# Altium project CHILD_BOARD.PrjPcb (part 2 of 2)

## Sheet 3V3_AUX.SchDoc
size A4; SheetNumber: 7; SheetTotal: 8
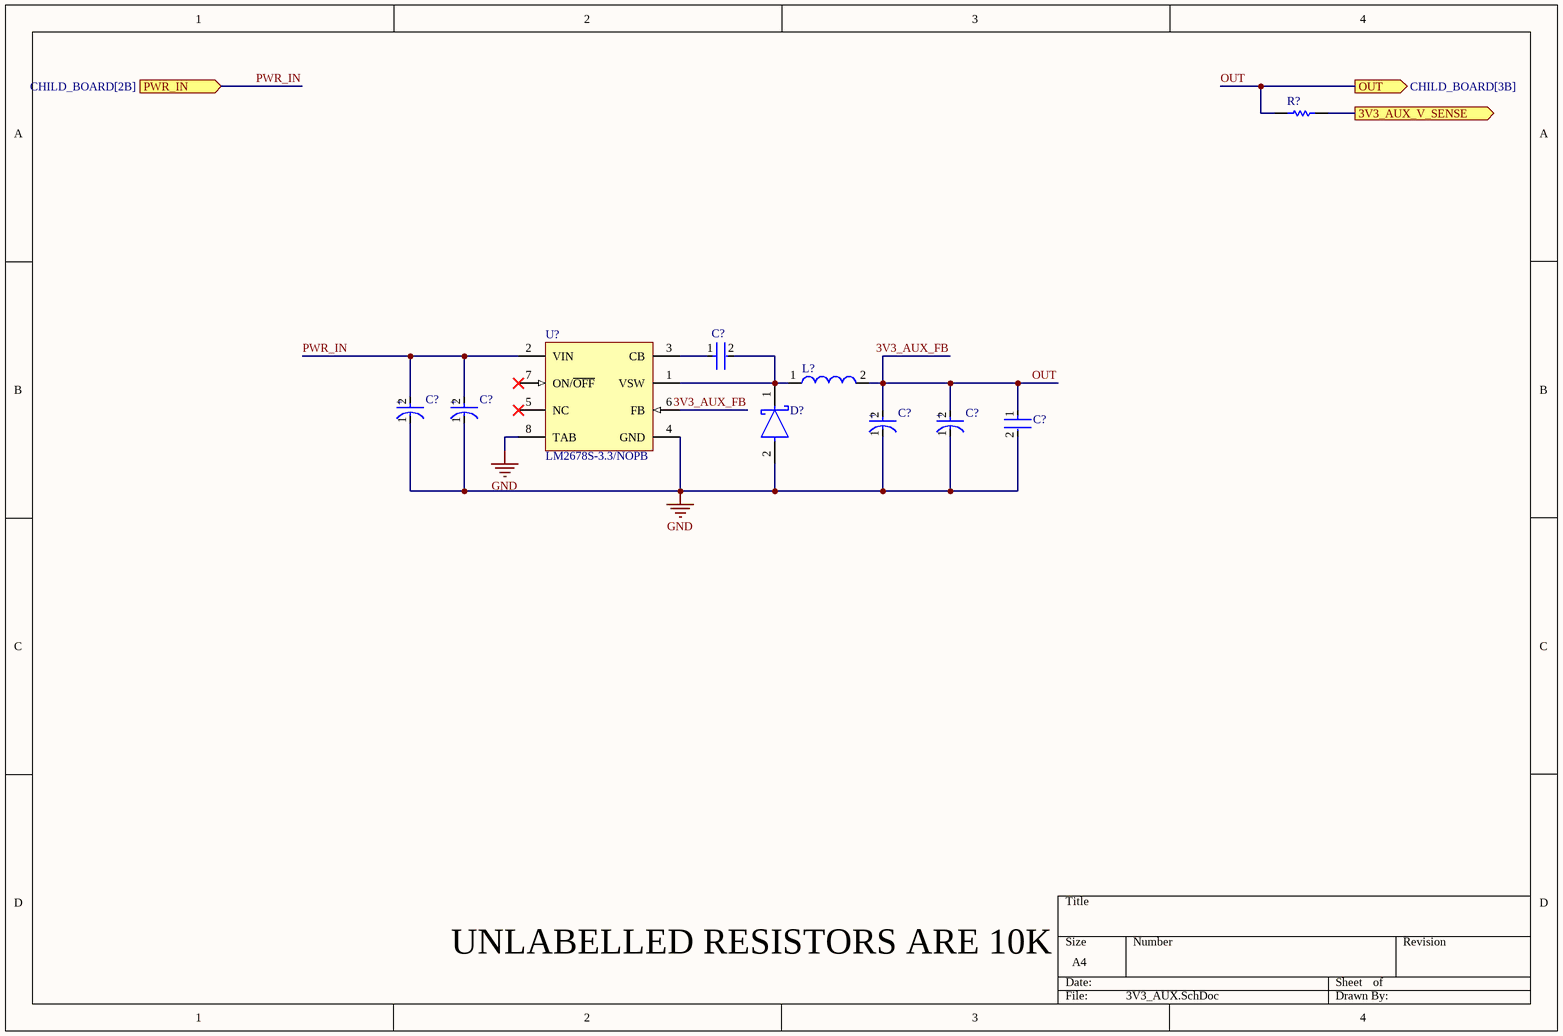
[diagram p6: 3V3_AUX.SchDoc]

### Parts
(Parts that share a designator on the sheet are numbered #1, #2 ... from top to bottom, then left to right.)
C?#43  C0805C103J5RACTU  [FP-C0805C-DN-MFG]  (value not drawn)
C?#44  EEHZA1V680XP  [FP-EEH-D8-MFG]  (value not drawn)
C?#45  EEHZA1V680XP  [FP-EEH-D8-MFG]  (value not drawn)
C?#46  16SVPC120M  [FP-OS-CON-SMT-E7-MFG]  (value not drawn)
C?#47  16SVPC120M  [FP-OS-CON-SMT-E7-MFG]  (value not drawn)
C?#48  GRM21BR61E226ME44L  [FP-GRM21B-0_2-e0_2_0_7-IPC_B]  (value not drawn)
D?#5  B540C-13-F  [FP-SMC-MFG]  (value not drawn)
L?#5  74477110  [WE-PD-L]  (value not drawn)
R?#71  ERJ3EKF1002V  [RESC1609X55X30LL15T15]  (value not drawn)
U?#11  LM2678S-3.3/NOPB  [KTW0007B_N]

### Ports
3V3_AUX_V_SENSE (out), OUT (out, see CHILD_BOARD[3B]), PWR_IN (in, see CHILD_BOARD[2B])

### Nets
3V3_AUX_FB: C?#46.2(A) C?#47.2(A) C?#48.1 L?#5.2 R?#71.1 U?#11.6(FB) ; port OUT  [also labelled OUT]
GND: C?#44.1(C) C?#45.1(C) C?#46.1(C) C?#47.1(C) C?#48.2 D?#5.2(A) U?#11.4(GND) U?#11.8(TAB)
3V3_AUX_V_SENSE: R?#71.2 ; port 3V3_AUX_V_SENSE
PWR_IN: C?#44.2(A) C?#45.2(A) U?#11.2(VIN) ; port PWR_IN  [project net 3V3_AUX_VCC]
NetC?#43_1: C?#43.1 U?#11.3(CB)
NetC?#43_2: C?#43.2 D?#5.1(C) L?#5.1 U?#11.1(VSW)

Not connected (* = marked no-connect by the designer): U?#11 5(NC)* 7(ON/~{OFF})*

### Notes on the sheet
- UNLABELLED RESISTORS ARE 10K
- (in symbol CMP-05428-000021-2) +
- (in symbol CMP-05428-001211-1) +

### Library data of the parts
C?#43 = CMP-2007-00254-2: CAP CER 10000PF 50V X7R 0805; Manufacturer: KEMET; Value: 10,000 pF; Material: Ceramic; Temperature Coefficient: 30ppm/°C; Tolerance: 0.05; Device Class L1: Passive Components; Temperature: -55°C to +125°C; Lead Free: Yes; ComponentLink2URL: https://content.kemet.com/datasheets/KEM_C1003_C0G_SMD.pdf; Device Class L3: Ceramic Capacitors; Temperature Characteristic: X7R; Temperature Range High: +125°C; Mouser Description: Capacitor; Ceramic; Cap 0.01uF; Tol 5%; Vol-Rtg 50 V; SMT; Case 0805; X7R; TR; ComponentLink2Description: Datasheet; Manufacturer Part Number: C0805C103J5RACTU; Height: 0.88mm; Digikey Description: CAP CER 10000PF 50V X7R 0805; Capacitance: 10,000 pF; Temperature Range Low: -55°C; Device Class L2: Capacitors; Octopart: https://octopart.com/c0805c103j5ractu-kemet-133473; Voltage Rating: 50 V; Category: Cap; RoHS: TRUE; Automotive: No; Package: C0805C-DN; Ipc Land Pattern Name: CAPC200125X78
C?#44 C?#45 = CMP-05428-001211-1: Conductive Polymer Hybrid Aluminum Electrolytic Capacitors 68uF ±20% 35V RADIAL SMT 6.3x7.7mm; Leakage Current: 23.8uA; Ripple Current (AC): 2A; Polarity: Polar; Life (Hours): 5000Hour; ESR (Equivalent Series Resistance): 35mR; Lead Diameter: 0.65mm; Termination: SMD/SMT; Case/Package: Radial; Package Quantity: 900; Radiation Hardening: No; Max Operating Temperature: 105°C; Capacitance: 68uF; Voltage Rating: 35V; Number of Pins: 8; Mount: Surface Mount; Technology: HYBRID; Diameter: 6.3mm; Min Operating Temperature: -55°C; Length: 7.7mm; Ratings: AEC-Q200; Height - Seated (Max): 0.315inch; Ripple Current: 2A; Lead Free: Lead Free; Voltage: 35V; Lead Pitch: 1.8mm; Voltage Rating (DC): 35V; REACH SVHC: No SVHC; Material: Polymer; Height: 7.7mm; Tolerance: 20%; Construction: Cylindrical; Packaging: Tape and Reel; Series: ZA
C?#46 C?#47 = CMP-05428-000021-2: Conductive Polymer Aluminum Solid Capacitors (OS-CON) 120uF ±20% 16V RADIAL SMT 8x6.9mm; Leakage Current: 500uA; Ripple Current: 2.9A; ESR (Equivalent Series Resistance): 27mR; Polarity: Polar; Dissipation Factor: 12%; Life (Hours): 2000Hour; Lead Free: Lead Free; Voltage Rating (DC): 16V; Min Operating Temperature: -55°C; Height - Seated (Max): 0.276inch; Case/Package: Radial; REACH SVHC: No SVHC; Diameter: 8mm; Mount: Surface Mount; Package Quantity: 1000; Construction: Cylindrical; Max Operating Temperature: 105°C; Capacitance: 120uF; Voltage: 16V; Length: 6.9mm; Tolerance: 20%; RoHS Compliant: Yes; Series: OS-CON, SVPC; Packaging: Tape and Reel; Voltage Rating: 16V; Termination: SMD/SMT; Number of Pins: 7; Ripple Current (AC): 2.9A; Height: 6.9mm
C?#48 = CMP-2007-03222-3: Chip Multilayer Ceramic Capacitors for General Purpose, 0805, 22uF, X5R, 15%, 20%, 25V; Case/Package: 0805; Depth: 1.25mm; Resistor Type: Ceramic; Voltage Rating: 25V; Lead Free: Lead Free; Voltage Rating (DC): 25V; Case Code (Metric): 2012; Thickness: 0.057inch; REACH SVHC: No SVHC; Material: Ceramic; Tolerance: 20%; Length: 2mm; Capacitance: 22uF; Case Code (Imperial): 0805; Max Operating Temperature: 85°C; Termination: SMD/SMT; Weight: 0.000335oz; Dielectric: X5R; Packaging: Tape and Reel; Voltage: 25V; Package Quantity: 3000; Height: 1.25mm; Mount: Surface Mount; Width: 1.25mm; Min Operating Temperature: -55°C
D?#5 = CMP-2000-05097-3: DIODE SCHOTTKY 40V 5A SMC; Manufacturer: Diodes Inc.; Automotive Grade: NA; Peak Reverse Current: 0.5mA; Value: 300pF; Max Junction Temp: +150°C; Max Surge Forward Current: 100A; Standoff Height: 0.1mm; Digikey Description: DIODE SCHOTTKY 40V 5A SMC; Temperature Range Low: -55°C; Manufacturer Part Number: B540C-13-F; Octopart: https://octopart.com/b540c-13-f-diodes+inc.-325873; Lead Free: Yes; Reverse Voltage: 40V; RoHS: TRUE; Category: Diode; Mouser Description: Diode: Schottky rectifying; SMD; 40V; 5A; SMC; Package: reel, tape; ComponentLink2Description: Datasheet; Temperature Range High: +150°C; Automotive: No; Footprint Url: https://www.diodes.com/assets/Package-Files/SMC.pdf; Device Class L3: Schottky Diodes; Height: 2.5mm; Forward Current: 5A; Temperature: -55°C to +150°C; Package: SMC; ComponentLink2URL: https://www.diodes.com/assets/Datasheets/ds13012.pdf; Device Class L2: Diodes; Max Repetitive Reverse Voltage: 40V; Device Class L1: Discrete Semiconductors; Capacitance: 300pF
L?#5 = CMP-0227-00708-1: as L?#1 on sheet AMPLIFIER; ComponentLink2Description: Datasheet; DatasheetVersion: ver 7, Sep-2006; PackageVersion: 2006; ComponentLink1URL: http://www.we-online.com; ComponentLink1Description: Manufacturer Link; ComponentLink2URL: http://www.we-online.de/katalog/media/pdf/74477110.pdf; PackageDescription: SMD Inductor, 2-Leads, Body 12.0 x 12.0 mm; PackageReference: WE-PD-L
R?#71 = CMP-1012-00623-3: Chip Resistor, 10 KOhm, +/- 1%, 0.1 W, -55 to 155 degC, 0603 (1608 Metric), RoHS, Tape and Reel; Manufacturer: Panasonic; Voltage Rating: 75V; Case\/Package: 0603; Power Rating: 100mW; Resistance: 10KOhm; Temperature Coefficient: 100ppm\/degreesC; Number of Pins: 2; Package Reference: 603; Depth: 0.8mm; Mount: SurfaceMount; Package Description: 2-Pin Surface Mount Device, Body 1.6 x 0.85 mm; Datasheet Version: 02/2017; Length: 1.6mm; Lead Free: LeadFree; Height: 0.45mm; Number of Terminations: 2; Max Power Dissipation: 100mW; Min Operating Temperature: -55degC; Datasheet URL: https://industrial.panasonic.com/cdbs/www-data/pdf/RDA0000/AOA0000C304.pdf; Termination: SMD/SMT; Case Code (Metric): 1608; Case Code (Imperial): 0603; Tolerance: 1%; Max Operating Temperature: 155degC; RoHSCompliant: true; Voltage Rating (DC): 75V; Radiation Hardening: No; Packaging: TapeandReel; Composition: ThickFilm; Mounting Technology: SurfaceMount; Manufacturer URL: http://www.panasonic.com/; Width: 0.031inch; REACH SVHC: NoSVHC; Contact Plating: Tin; Military Standard: Not; Package Quantity: 1
U?#11 = CMP-0069-00195-3: SIMPLE SWITCHER® High Efficiency 5A Step-Down Voltage Regulator, 7-pin TO-263, Pb-Free; Manufacturer: Texas Instruments; PackageTopMarking: NSUZXYTTE#*LM2678*S-3.3; PowerWise: N; PackageReference: KTW0007B; Code_JEDEC: MO-169-AC; CompType: Switcher; RoHS: Y; PackageDescription: TO-263, Molded, .400 x .390 x .180in Body, 7 Lead, .050in Pitch, Surface Mount; ComponentLink1Description: Datasheet URL; PinCount: 7; ComponentLink1URL: http://www.ti.com/general/docs/lit/getliterature.tsp?genericPartNumber=LM2678&fileType=pdf

## Sheet ADC.SchDoc
size A4; SheetNumber: 8; SheetTotal: 8
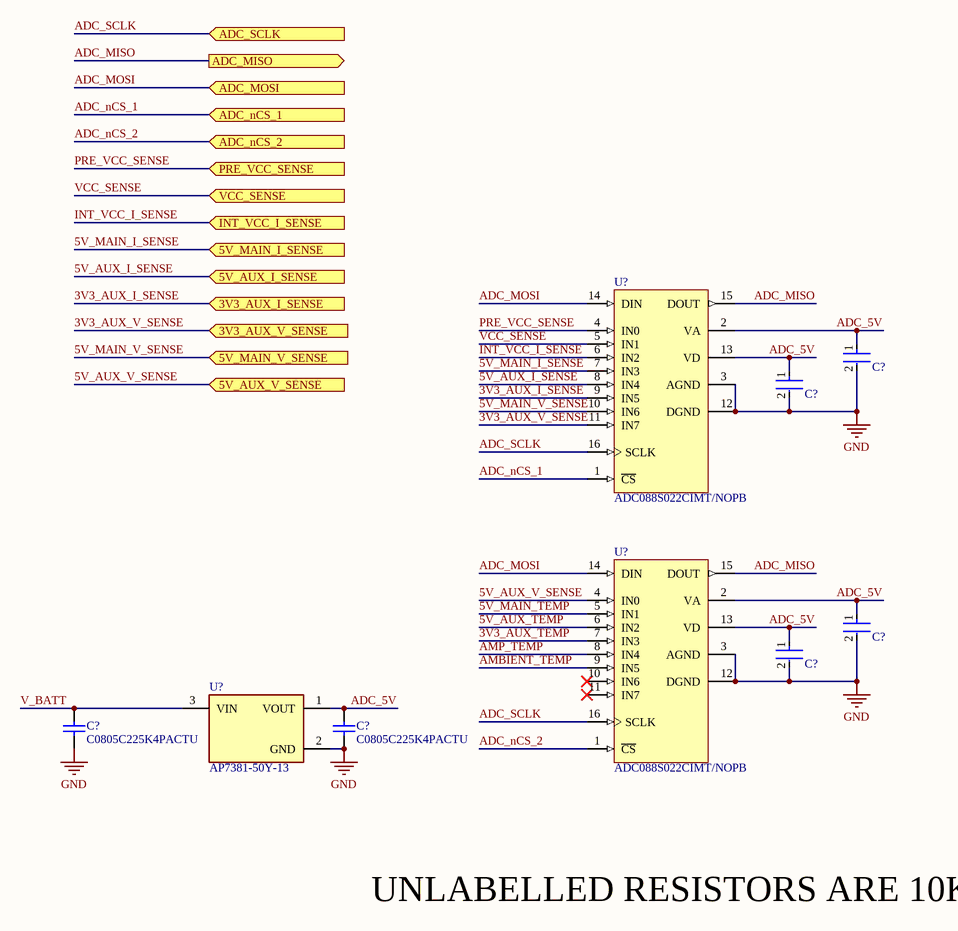
[diagram p7: ADC.SchDoc]

### Parts
(Parts that share a designator on the sheet are numbered #1, #2 ... from top to bottom, then left to right.)
C?#49  C0402C104K8PACTU  [FP-C0402-BB-MFG]  (value not drawn)
C?#50  C0402C104K8PACTU  [FP-C0402-BB-MFG]  (value not drawn)
C?#51  C0402C104K8PACTU  [FP-C0402-BB-MFG]  (value not drawn)
C?#52  C0402C104K8PACTU  [FP-C0402-BB-MFG]  (value not drawn)
C?#53  C0805C225K4PACTU  [CAPC2013X145X50ML20T25]
C?#54  C0805C225K4PACTU  [CAPC2013X145X50ML20T25]
U?#12  ADC088S022CIMT/NOPB  [MTC16_L]
U?#13  ADC088S022CIMT/NOPB  [MTC16_L]
U?#14  AP7381-50Y-13  [FP-SOT89-MFG]

### Ports
3V3_AUX_I_SENSE (in, see CHILD_BOARD[3B], PWR_MGMT[6A]), 3V3_AUX_V_SENSE (in, see CHILD_BOARD[3B]), 5V_AUX_I_SENSE (in, see CHILD_BOARD[3B], PWR_MGMT[6A]), 5V_AUX_V_SENSE (in, see CHILD_BOARD[3B]), 5V_MAIN_I_SENSE (in, see CHILD_BOARD[3B], PWR_MGMT[6A]), 5V_MAIN_V_SENSE (in, see CHILD_BOARD[3A]), ADC_MISO (out), ADC_MOSI (in), ADC_nCS_1 (in), ADC_nCS_2 (in), ADC_SCLK (in), INT_VCC_I_SENSE (in, see CHILD_BOARD[3B], PWR_MGMT[6A]), PRE_VCC_SENSE (in, see CHILD_BOARD[3B], PWR_MGMT[6A]), VCC_SENSE (in, see CHILD_BOARD[3B], PWR_MGMT[6A])

### Nets
GND: C?#49.2 C?#50.2 C?#51.2 C?#52.2 C?#53.1 C?#54.1 U?#12.3(AGND) U?#12.12(DGND) U?#13.3(AGND) U?#13.12(DGND) U?#14.2(GND)
3V3_AUX_I_SENSE: U?#12.9(IN5) ; port 3V3_AUX_I_SENSE
3V3_AUX_TEMP: U?#13.7(IN3)
3V3_AUX_V_SENSE: U?#12.11(IN7) ; port 3V3_AUX_V_SENSE
5V_AUX_I_SENSE: U?#12.8(IN4) ; port 5V_AUX_I_SENSE
5V_AUX_TEMP: U?#13.6(IN2)
5V_AUX_V_SENSE: U?#13.4(IN0) ; port 5V_AUX_V_SENSE
5V_MAIN_I_SENSE: U?#12.7(IN3) ; port 5V_MAIN_I_SENSE
5V_MAIN_TEMP: U?#13.5(IN1)
5V_MAIN_V_SENSE: U?#12.10(IN6) ; port 5V_MAIN_V_SENSE
ADC_5V: C?#49.1 C?#50.1 C?#51.1 C?#52.1 C?#54.2 U?#12.2(VA) U?#12.13(VD) U?#13.2(VA) U?#13.13(VD) U?#14.1(VOUT)
ADC_MISO: U?#12.15(DOUT) U?#13.15(DOUT) ; port ADC_MISO
ADC_MOSI: U?#12.14(DIN) U?#13.14(DIN) ; port ADC_MOSI
ADC_nCS_1: U?#12.1(~{CS}) ; port ADC_nCS_1
ADC_nCS_2: U?#13.1(~{CS}) ; port ADC_nCS_2
ADC_SCLK: U?#12.16(SCLK) U?#13.16(SCLK) ; port ADC_SCLK
AMBIENT_TEMP: U?#13.9(IN5)
AMP_TEMP: U?#13.8(IN4)
INT_VCC_I_SENSE: U?#12.6(IN2) ; port INT_VCC_I_SENSE
PRE_VCC_SENSE: U?#12.4(IN0) ; port PRE_VCC_SENSE
V_BATT: C?#53.2 U?#14.3(VIN)
VCC_SENSE: U?#12.5(IN1) ; port VCC_SENSE

Not connected (* = marked no-connect by the designer): U?#13 10(IN6)* 11(IN7)*

### Notes on the sheet
- UNLABELLED RESISTORS ARE 10K

### Library data of the parts
C?#49-C?#52 = CMP-2008-02046-2: CAP CER 0.1UF 10V X5R 0402; Manufacturer: Kemet; Material: Ceramic; Capacitance: 0.10 μF; Temperature Coefficient: 15%; Tolerance: 0.1; Value: 0.10 μF; Package: C0402-BB; Temperature: -55°C to +125°C; ComponentLink2Description: Datasheet; Temperature Characteristic: X5R; Device Class L1: Passive Components; Height: 0.55mm; Lead Free: Yes; ComponentLink2URL: https://content.kemet.com/datasheets/KEM_C1002_X7R_SMD.pdf; Device Class L2: Capacitors; Temperature Range Low: -55°C; Temperature Range High: +125°C; RoHS: TRUE; Octopart: https://octopart.com/c0402c104k8pactu-kemet-140039; Automotive: No; Mouser Description: Capacitor 100 nF 10 VDC 0402; Category: Cap; Voltage Rating: 10 V; Digikey Description: CAP CER 0.1UF 10V X5R 0402; Ipc Land Pattern Name: CAPC10050X50; Device Class L3: Ceramic Capacitors; Manufacturer Part Number: C0402C104K8PACTU
C?#53 C?#54 = CMP-2007-01026-1: Manufacturer: Kemet; Part Number: C0805C225K4PACTU
U?#12 U?#13 = CMP-0054-00372-2: 8-Channel, 50 kSPS to 200 kSPS, 8-Bit A/D Converter, 16-pin TSSOP, Pb-Free; Manufacturer: National Semiconductor; PackageTopMarking: NSUZXYTT*88S022*CIMT; CompType: ADC IC; PowerWise: Y; ComponentLink2URL: http://www.national.com/pf/AD/ADC088S022.html; RoHS: Y; PackageDescription: Molded TSSOP, Jedec, 5 x 4.4 x 0.9mm Body, 16 Lead, 0.65mm Pitch; DatasheetVersion: Feb-2010; PinCount: 16; ComponentLink1Description: ADC088S022 Datasheet; Code_JEDEC: MO-153-AB; ComponentLink3URL: http://www.national.com/packaging/folders/mtc16.html; PackageVersion: revD, Jun-2003; ComponentLink3Description: MTC16 Package Page; RevisionNote: Component URLs added; ComponentLink1URL: http://www.national.com/ds/AD/ADC088S022.pdf; ComponentLink2Description: ADC088S022 Web Page; PackageReference: MTC16
U?#14 = CMP-12756-000009-1: IC REG LINEAR 5V 150MA SOT89; Manufacturer: Diodes Inc.; Output Type: Fixed; Min Supply Voltage: 3.3V; Max Junction Temp: +125°C; Max Supply Voltage: 40V; Nominal Supply Current: 2.5-25uA; Number Of Outputs: 1; Dropout Voltage: 1000mV; Description: Linear Voltage Regulator IC  1 Output  150mA SOT-89; Manufacturer Part Number: AP7381-50Y-13; RoHS: TRUE; Digikey Description: IC REG LINEAR 5V 150MA SOT89; Output Voltage: 5V; Footprint Url: https://www.diodes.com/assets/Package-Files/SOT89.pdf; Category: IC; Temperature: -40°C to +125°C; ComponentLink2Description: Datasheet; Package: SOT89; Temperature Range Low: -40°C; Temperature Range High: +125°C; ComponentLink2URL: https://www.diodes.com/assets/Datasheets/AP7381.pdf; Device Class L1: Integrated Circuits (ICs); Automotive: No; Output Current: 150mA; Ambient Temperature Range High: +85°C; Octopart: https://octopart.com/ap7381-50y-13-diodes+inc.-87775116; Lead Free: Yes; Device Class L2: Power Management ICs; Height: 1.6mm; Device Class L3: Voltage Regulators - Linear; Ambient Temperature Range Low: -40°C

## Nets that join several sheets
3V3_AUX_FB: AMPLIFIER (R?#50.2), 3V3_AUX (6 pins)
5V_AUX_FB: AMPLIFIER (C?#11.2 C?#12.2 R?#51.2 U?#6.11), CAN (C?#20.2 C?#21.2 U?#8.3 U?#8.5), 5V_AUX (6 pins)
GND: CHILD_BOARD (J?#2.3 J?#2.4 J?#3.7 J?#3.8), PWR_MGMT (19 pins), AMPLIFIER (15 pins), CAN (6 pins), 5V_MAIN (11 pins), 5V_AUX (11 pins), 3V3_AUX (8 pins), ADC (11 pins)
SPKR_NEG: CHILD_BOARD (J?#5.3 J?#5.4), AMPLIFIER (11 pins)
3V3_AUX_I_SENSE: PWR_MGMT (R?#35.2 R?#37.2), ADC (U?#12.9)
3V3_AUX_V_SENSE: 3V3_AUX (R?#71.2), ADC (U?#12.11)
3V3_AUX_VCC: PWR_MGMT (R?#11.2 R?#31.1), 3V3_AUX (C?#44.2 C?#45.2 U?#11.2)
5V_AUX_I_SENSE: PWR_MGMT (R?#18.2 R?#22.2), ADC (U?#12.8)
5V_AUX_V_SENSE: 5V_AUX (R?#69.2 R?#70.2), ADC (U?#13.4)
5V_AUX_VCC: PWR_MGMT (R?#10.2 R?#14.1), 5V_AUX (5 pins)
5V_MAIN_I_SENSE: PWR_MGMT (R?#34.2 R?#36.2), ADC (U?#12.7)
5V_MAIN_V_SENSE: 5V_MAIN (R?#63.1 R?#64.2), ADC (U?#12.10)
5V_MAIN_VCC: PWR_MGMT (R?#9.2 R?#30.1), 5V_MAIN (7 pins)
CAN0_N: CHILD_BOARD (J?#1.2), CAN (R?#59.1 U?#8.12)
CAN0_P: CHILD_BOARD (J?#1.1), CAN (R?#59.2 U?#8.13)
CAN_INH: PWR_MGMT (R?#2.1 R?#6.1), CAN (U?#8.7)
INT_VCC_I_SENSE: PWR_MGMT (R?#21.2 R?#25.2), ADC (U?#12.6)
PRE_VCC_SENSE: PWR_MGMT (R?#19.2 R?#23.2), ADC (U?#12.4)
PWR_IN: CHILD_BOARD (J?#2.1 J?#2.2 J?#3.5 J?#3.6), PWR_MGMT (F?.1), CAN (C?#22.2 R?#60.1 U?#8.10)
SPKR_POS: CHILD_BOARD (J?#4.1 J?#4.2), AMPLIFIER (C?#3.2 L?#1.2)
VCC_SENSE: PWR_MGMT (R?#20.2 R?#24.2), ADC (U?#12.5)